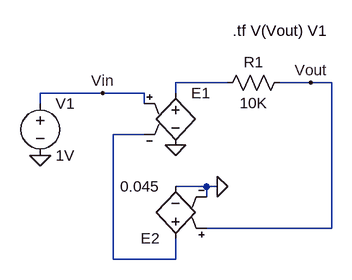
[diagram p0: schematic vcvs.asc]
vcvs.asc, the LTspice schematic file:
Version 4
SHEET 1 880 680
WIRE 304 112 224 112
WIRE 432 112 384 112
WIRE 464 112 432 112
WIRE 112 128 16 128
WIRE 176 128 112 128
WIRE 224 128 224 112
WIRE 16 144 16 128
WIRE 176 144 176 128
WIRE 176 192 128 192
WIRE 272 272 224 272
WIRE 288 272 272 272
WIRE 272 288 272 272
WIRE 464 336 464 112
WIRE 464 336 272 336
WIRE 128 384 128 192
WIRE 224 384 224 352
WIRE 224 384 128 384
FLAG 224 208 0
FLAG 432 112 Vout
FLAG 112 128 Vin
FLAG 288 272 0
FLAG 16 224 0
SYMBOL voltage 16 128 R0
WINDOW 123 0 0 Left 0
WINDOW 39 0 0 Left 0
SYMATTR InstName V1
SYMATTR Value 1V
SYMBOL e 224 112 R0
WINDOW 3 24 96 Invisible 2
SYMATTR InstName E1
SYMATTR Value 200
SYMBOL e 224 368 R180
SYMATTR InstName E2
SYMATTR Value 0.045
SYMBOL res 400 96 R90
WINDOW 0 0 56 VBottom 2
WINDOW 3 32 56 VTop 2
SYMATTR InstName R1
SYMATTR Value 10K
TEXT 312 32 Left 2 !.tf V(Vout) V1

The netlist it stands for:
* vcvs.asc
V1 Vin 0 1V
E1 N001 0 Vin N002 200
E2 N002 0 Vout 0 0.045
R1 Vout N001 10K
.tf V(Vout) V1
.backanno
.end